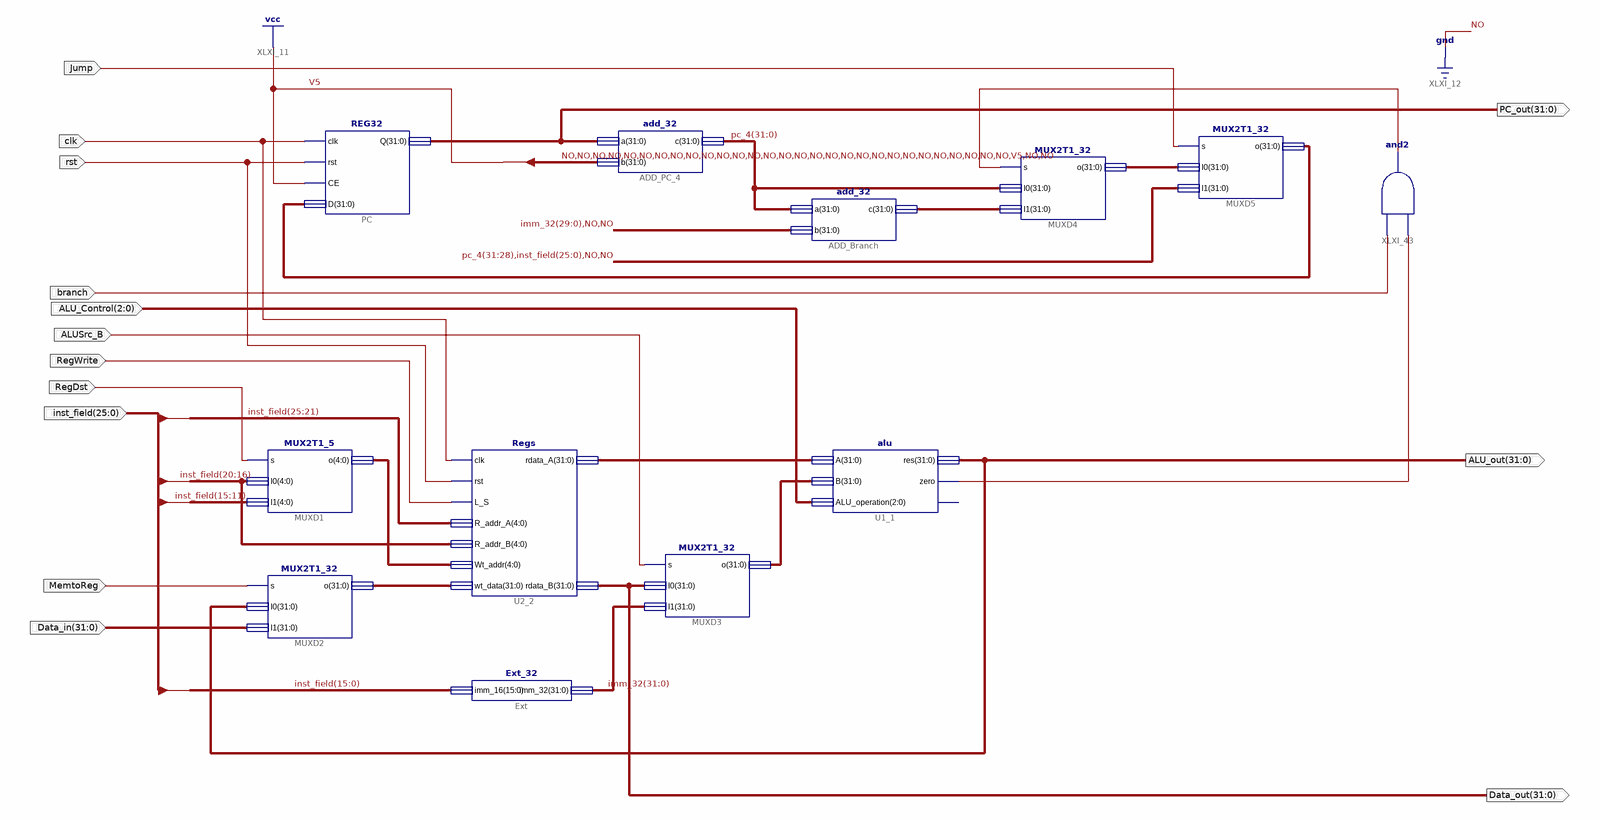
[diagram p0: schematic sheet 1]
// Xilinx ISE schematic Dat_path.sch (kintex7) as structural Verilog: 12 symbols, 14 ports
module Dat_path (
  input  RegWrite,
  input  MemtoReg,
  input  [31:0] Data_in,
  input  ALUSrc_B,
  input  [2:0] ALU_Control,
  input  rst,
  input  Jump,
  input  branch,
  input  clk,
  input  RegDst,
  input  [25:0] inst_field,
  output [31:0] Data_out,
  output [31:0] ALU_out,
  output [31:0] PC_out
);

  wire XLXN_96, XLXN_104;
  wire [4:0] XLXN_4;
  wire [31:0] imm_32, pc_4, pc_back, XLXN_1, XLXN_3, XLXN_5, XLXN_65, XLXN_66;

  Regs U2_2 (
    .clk(clk), .rst(rst), .L_S(RegWrite), .R_addr_A(inst_field[25:21]), .R_addr_B(inst_field[20:16]),
    .Wt_addr(XLXN_4), .wt_data(XLXN_5), .rdata_A(XLXN_1), .rdata_B(Data_out));
  MUX2T1_32 MUXD3 (.s(ALUSrc_B), .I0(Data_out), .I1(imm_32), .o(XLXN_3));
  alu U1_1 (.A(XLXN_1), .B(XLXN_3), .ALU_operation(ALU_Control), .res(ALU_out), .zero(XLXN_96));  // open: overflow
  Ext_32 Ext (.imm_16(inst_field[15:0]), .imm_32(imm_32));
  REG32 PC (.clk(clk), .rst(rst), .CE(1'b1), .D(pc_back), .Q(PC_out));
  add_32 ADD_PC_4 (.a(PC_out), .b(32'b00000000000000000000000000000100), .c(pc_4));
  add_32 ADD_Branch (.a(pc_4), .b({imm_32[29:0], 2'b00}), .c(XLXN_65));
  MUX2T1_32 MUXD4 (.s(XLXN_104), .I0(pc_4), .I1(XLXN_65), .o(XLXN_66));
  MUX2T1_32 MUXD5 (.s(Jump), .I0(XLXN_66), .I1({pc_4[31:28], inst_field, 2'b00}), .o(pc_back));
  and XLXI_43 (XLXN_104, XLXN_96, branch);
  MUX2T1_32 MUXD2 (.s(MemtoReg), .I0(ALU_out), .I1(Data_in), .o(XLXN_5));
  MUX2T1_5 MUXD1 (.s(RegDst), .I0(inst_field[20:16]), .I1(inst_field[15:11]), .o(XLXN_4));
endmodule
